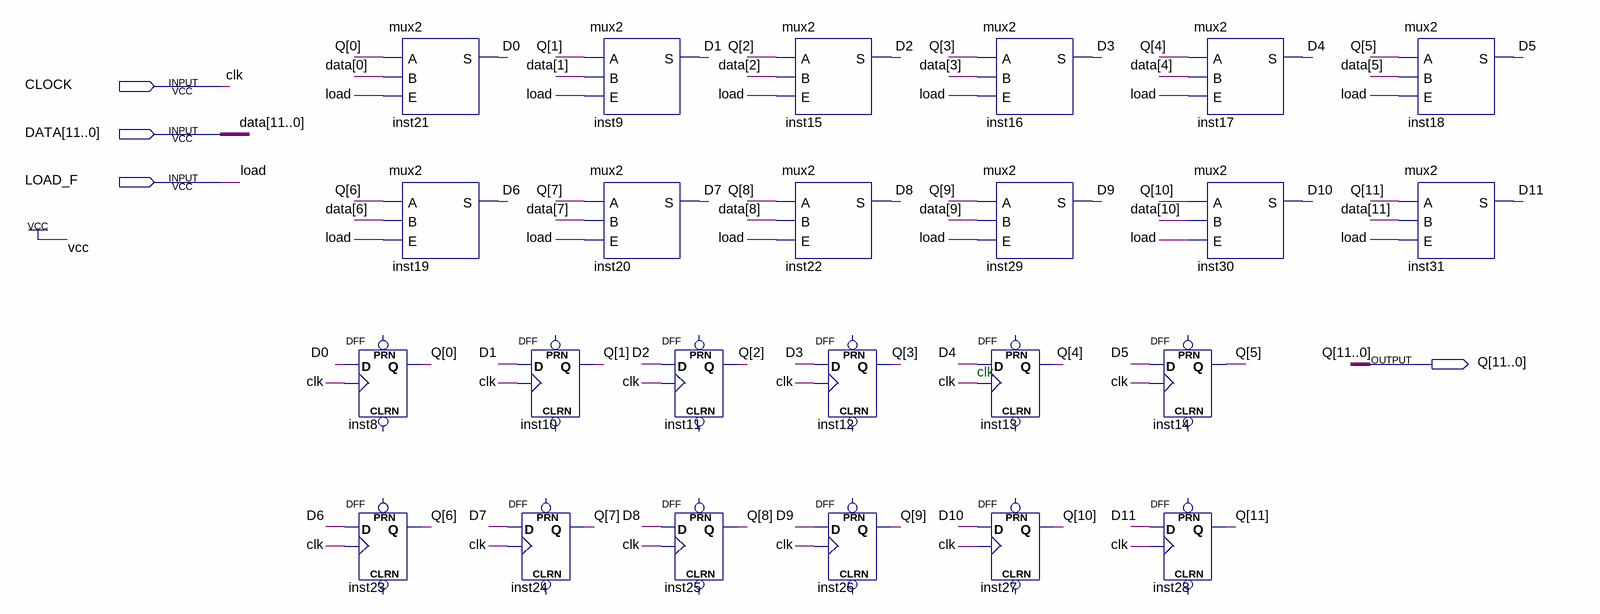
[diagram p0: schematic sheet]
// Quartus schematic reg_final.bdf as structural Verilog: 24 symbols, 4 pins
module reg_final (
  input  CLOCK,
  input  [11:0] DATA,
  input  LOAD_F,
  output [11:0] Q
);

  wire D0, D1, D2, D3, D4, D5, D6, D7, D8, D9, D10, D11;

  DFF inst8 (.CLK(CLOCK), .D(D0), .Q(Q[0]));  // open: CLRN, PRN
  DFF inst23 (.CLK(CLOCK), .D(D6), .Q(Q[6]));  // open: CLRN, PRN
  mux2 inst21 (.A(Q[0]), .B(DATA[0]), .E(LOAD_F), .S(D0));
  mux2 inst19 (.A(Q[6]), .B(DATA[6]), .E(LOAD_F), .S(D6));
  DFF inst10 (.CLK(CLOCK), .D(D1), .Q(Q[1]));  // open: CLRN, PRN
  DFF inst24 (.CLK(CLOCK), .D(D7), .Q(Q[7]));  // open: CLRN, PRN
  mux2 inst9 (.A(Q[1]), .B(DATA[1]), .E(LOAD_F), .S(D1));
  mux2 inst20 (.A(Q[7]), .B(DATA[7]), .E(LOAD_F), .S(D7));
  DFF inst11 (.CLK(CLOCK), .D(D2), .Q(Q[2]));  // open: CLRN, PRN
  DFF inst25 (.CLK(CLOCK), .D(D8), .Q(Q[8]));  // open: CLRN, PRN
  mux2 inst15 (.A(Q[2]), .B(DATA[2]), .E(LOAD_F), .S(D2));
  mux2 inst22 (.A(Q[8]), .B(DATA[8]), .E(LOAD_F), .S(D8));
  DFF inst12 (.CLK(CLOCK), .D(D3), .Q(Q[3]));  // open: CLRN, PRN
  DFF inst26 (.CLK(CLOCK), .D(D9), .Q(Q[9]));  // open: CLRN, PRN
  mux2 inst16 (.A(Q[3]), .B(DATA[3]), .E(LOAD_F), .S(D3));
  mux2 inst29 (.A(Q[9]), .B(DATA[9]), .E(LOAD_F), .S(D9));
  DFF inst13 (.CLK(CLOCK), .D(D4), .Q(Q[4]));  // open: CLRN, PRN
  DFF inst27 (.CLK(CLOCK), .D(D10), .Q(Q[10]));  // open: CLRN, PRN
  mux2 inst17 (.A(Q[4]), .B(DATA[4]), .E(LOAD_F), .S(D4));
  mux2 inst30 (.A(Q[10]), .B(DATA[10]), .E(LOAD_F), .S(D10));
  DFF inst14 (.CLK(CLOCK), .D(D5), .Q(Q[5]));  // open: CLRN, PRN
  DFF inst28 (.CLK(CLOCK), .D(D11), .Q(Q[11]));  // open: CLRN, PRN
  mux2 inst18 (.A(Q[5]), .B(DATA[5]), .E(LOAD_F), .S(D5));
  mux2 inst31 (.A(Q[11]), .B(DATA[11]), .E(LOAD_F), .S(D11));

  // Other names for the same wires on the sheet: clk = CLOCK; load = LOAD_F

  // Notes on the sheet:
  //   clk
endmodule
